# Altium project 数据收集器_Project.PrjPcb
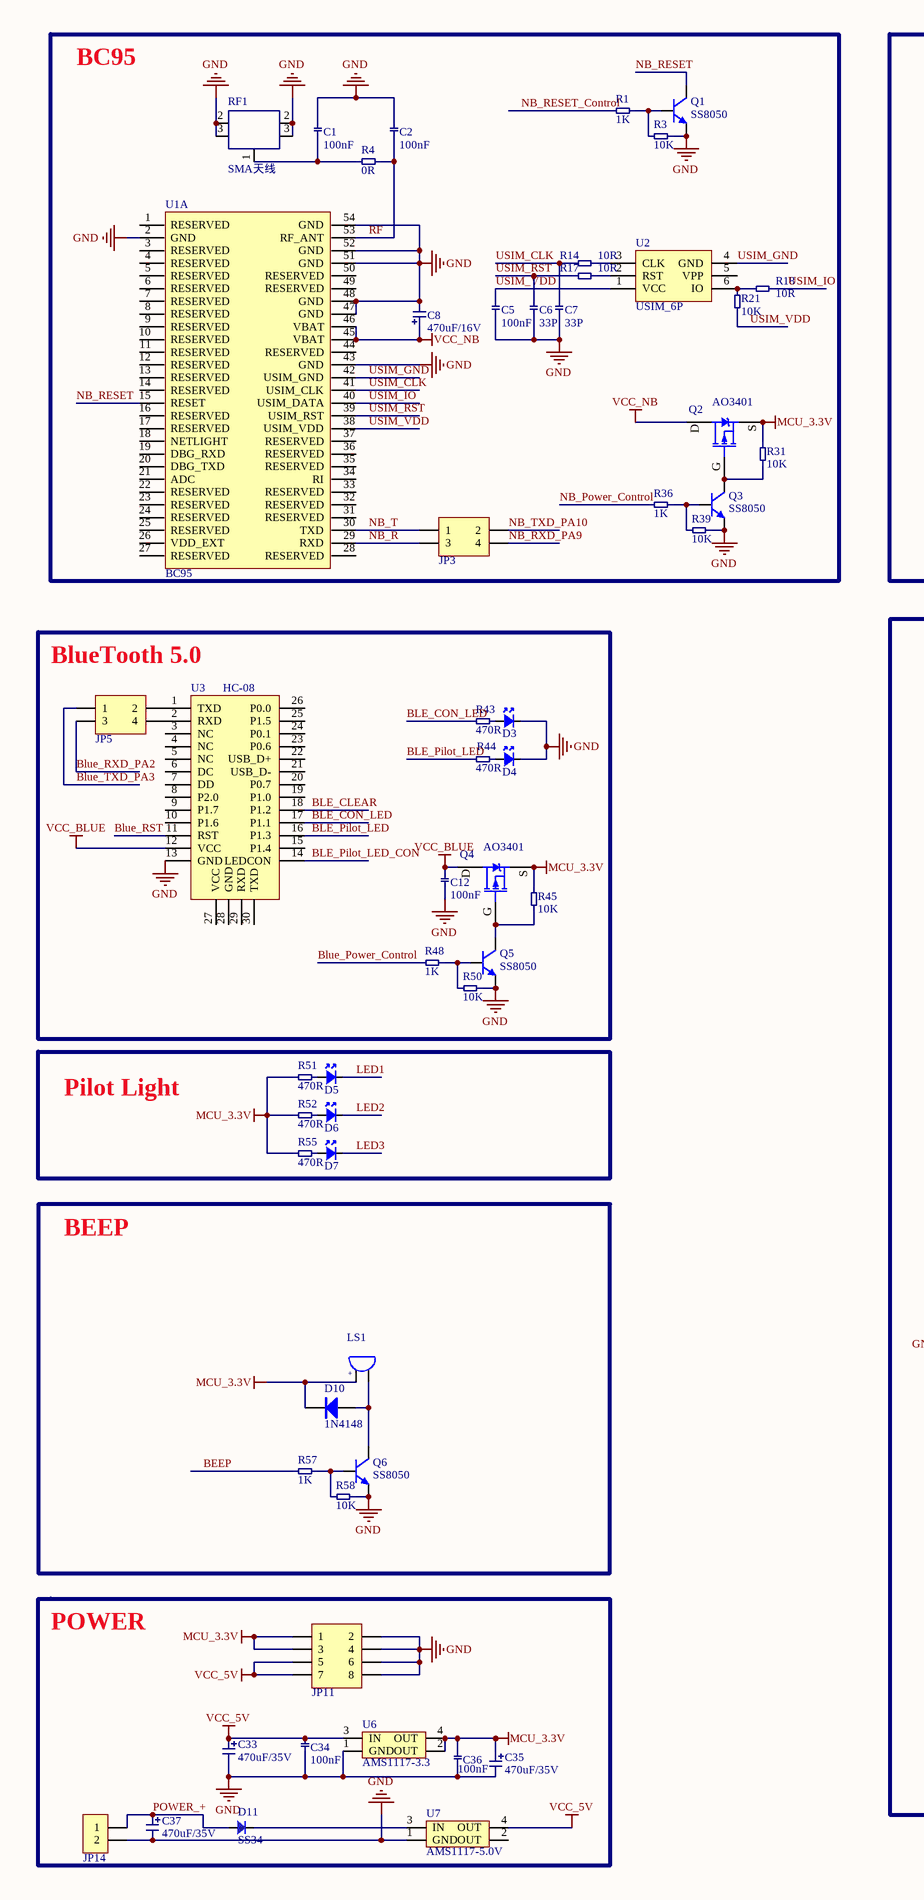
[diagram p0: MCU.SchDoc, left]
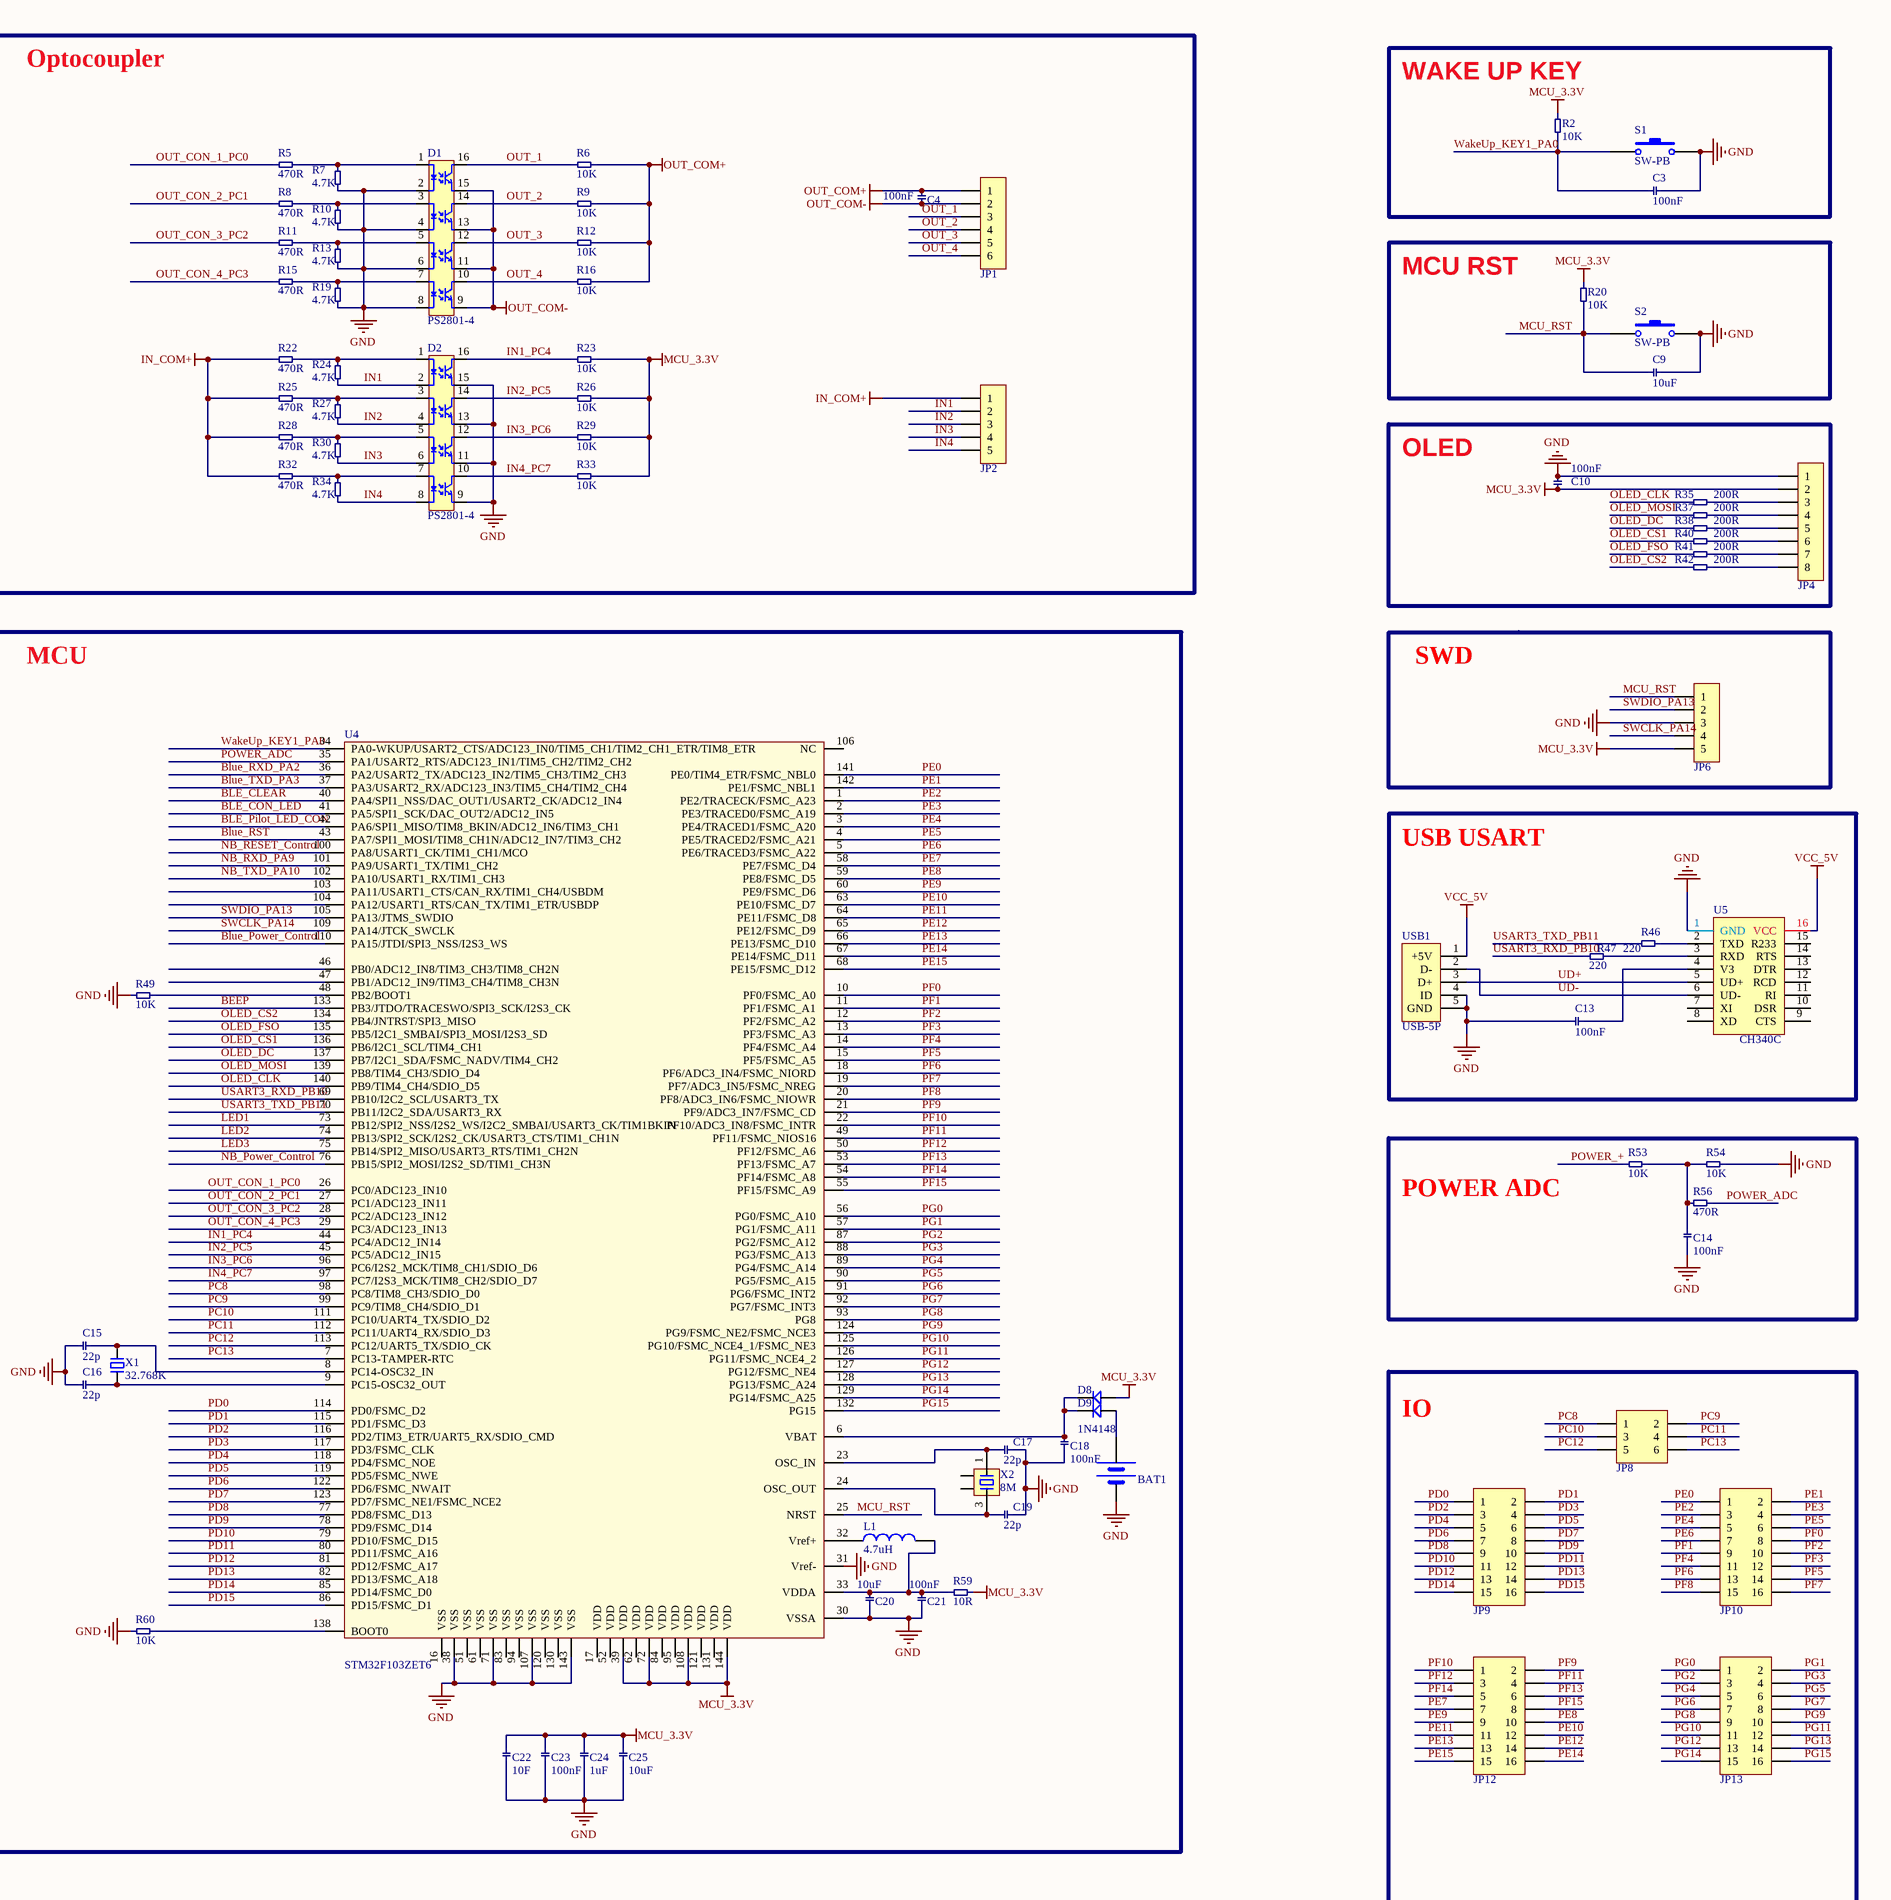
[diagram p1: MCU.SchDoc, right]
1 sheet, 135 parts. Net scope: global (net labels, ports and power ports of the same name join across sheets).
Board files: Main_Board.PcbDoc, PCB1_4.PcbDoc

## Sheet MCU.SchDoc
size A2; Organization: Altium Limited; Address1: L3, 12a Rodborough Rd; Address2: Frenchs Forest; Address3: NSW; Address4: Australia 2086

### Parts
BAT1  BATT  [VBAT]  (value not drawn)
C1  100nF  [0603CC]
C2  100nF  [0603CC]
C3  100nF  [0603CC]
C4  100nF  [0603CC]
C5  100nF  [0603CC]
C6  33P  [0603CC]
C7  33P  [0603CC]
C8  470uF/16V  [C3216]
C9  10uF  [0603CC]
C10  100nF  [0603CC]
C12  100nF  [0603CC]
C13  100nF  [0603CC]
C14  100nF  [0603CC]
C15  22p  [0603CC]
C16  22p  [0603CC]
C17  22p  [0603CC]
C18  100nF  [0603CC]
C19  22p  [0603CC]
C20  10uF  [0603CC]
C21  100nF  [0603CC]
C22  10F  [0603CC]
C23  100nF  [0603CC]
C24  1uF  [0603CC]
C25  10uF  [0603CC]
C33  470uF/35V  [CD A(3216)]
C34  100nF  [0603CC]
C35  470uF/35V  [C3216]
C36  100nF  [0603CC]
C37  470uF/35V  [CD A(3216)]
D1  PS2801-4  [SOP16_N]
D2  PS2801-4  [SOP16_N]
D3  LED  [LED 0603G]  (value not drawn)
D4  LED  [LED 0603R]  (value not drawn)
D5  LED  [LED 3MM-G]  (value not drawn)
D6  LED  [LED 3MM-B]  (value not drawn)
D7  LED  [LED 3MM-R]  (value not drawn)
D8  1N4148  [SOD-323]  (value not drawn)
D9  1N4148  [SOD-323]
D10  1N4148  [SOD-323]
D11  SS34  [SMA]
JP1  HDR-1X6  [XH2.54-LI-6P]  (value not drawn)
JP2  HDR-1X5  [XH2.54-LI-5P]  (value not drawn)
JP3  Header2X2  [HDR2.54-LI-2x2P]  (value not drawn)
JP4  HDR-1X8  [HDR2.54-M-LI-8P]  (value not drawn)
JP5  Header2X2  [HDR2.54-LI-2x2P]  (value not drawn)
JP6  HDR-1X5  [HDR2.54-LI-5P]  (value not drawn)
JP8  Header3X2  [HDR2.54-LI-2x3P]  (value not drawn)
JP9  Header 8X2  [HDR2.54-LI-2x8P]  (value not drawn)
JP10  Header 8X2  [HDR2.54-LI-2x8P]  (value not drawn)
JP11  Header 4X2  [HDR2.54-LI-2x4P]  (value not drawn)
JP12  Header 8X2  [HDR2.54-LI-2x8P]  (value not drawn)
JP13  Header 8X2  [HDR2.54-LI-2x8P]  (value not drawn)
JP14  HDR-1X2  [XH2.54-LI-2P]  (value not drawn)
L1  4.7uH  [L 0603]
LS1  DC5V  [BEEP 5x9x5.5]  (value not drawn)
Q1  SS8050  [SOT23-3N]
Q2  AO3401  [SOT23-3N]
Q3  SS8050  [SOT23-3N]
Q4  AO3401  [SOT23-3N]
Q5  SS8050  [SOT23-3N]
Q6  SS8050  [SOT23-3N]
R1  1K  [0603RR]
R2  10K  [0603RR]
R3  10K  [0603RR]
R4  0R  [0603RR]
R5  470R  [0603RR]
R6  10K  [0603RR]
R7  4.7K  [0603RR]
R8  470R  [0603RR]
R9  10K  [0603RR]
R10  4.7K  [0603RR]
R11  470R  [0603RR]
R12  10K  [0603RR]
R13  4.7K  [0603RR]
R14  10R  [0603RR]
R15  470R  [0603RR]
R16  10K  [0603RR]
R17  10R  [0603RR]
R18  10R  [0603RR]
R19  4.7K  [0603RR]
R20  10K  [0603RR]
R21  10K  [0603RR]
R22  470R  [0603RR]
R23  10K  [0603RR]
R24  4.7K  [0603RR]
R25  470R  [0603RR]
R26  10K  [0603RR]
R27  4.7K  [0603RR]
R28  470R  [0603RR]
R29  10K  [0603RR]
R30  4.7K  [0603RR]
R31  10K  [0603RR]
R32  470R  [0603RR]
R33  10K  [0603RR]
R34  4.7K  [0603RR]
R35  200R  [0603RR]
R36  1K  [0603RR]
R37  200R  [0603RR]
R38  200R  [0603RR]
R39  10K  [0603RR]
R40  200R  [0603RR]
R41  200R  [0603RR]
R42  200R  [0603RR]
R43  470R  [0603RR]
R44  470R  [0603RR]
R45  10K  [0603RR]
R46  220  [0603RR]
R47  220  [0603RR]
R48  1K  [0603RR]
R49  10K  [0603RR]
R50  10K  [0603RR]
R51  470R  [0603RR]
R52  470R  [0603RR]
R53  10K  [0603RR]
R54  10K  [0603RR]
R55  470R  [0603RR]
R56  470R  [0603RR]
R57  1K  [0603RR]
R58  10K  [0603RR]
R59  10R  [0603RR]
R60  10K  [0603RR]
RF1  SMA天线
S1  SW-PB  [TSW SMD-6*6*6]
S2  SW-PB  [TSW SMD-4*4*1.5]
U1  BC95  [BC95]  (part A of 2)
U2  USIM_6P  [SIM 6P 自弹]
U3  HC-08  [HC-08]
U4  STM32F103ZET6  [LQFP144 20X20_L]
U5  CH340C  [SOP16_L]
U6  AMS1117-3.3  [SOT223_N]
U7  AMS1117-5.0V  [SOT223_N]
USB1  USB-5P  [USB-MICRO_A]
X1  32.768K  [OSC 3215-2P]
X2  8M  [OSC 3225-4P]

### Nets
GND: BAT1.2(GND) C1.2 C2.2 C3.2 C5.1 C6.1 C7.1 C8.2 C9.1 C10.2 C12.1 C13.2 C14.1 C15.2 C16.2 C17.1 C18.1 C19.1 C20.1 C21.1 C22.1 C23.1 C24.1 C25.1 C33.2 C34.1 C35.2 C36.1 C37.2 D1.2(IN_N) D1.4(IN_N) D1.6(IN_N) D1.8(IN_N) D2.9(OUT_E) D2.11(OUT_E) D2.13(OUT_E) D2.15(OUT_E) D3.2(CATHODE) D4.2(CATHODE) JP4.1 JP6.3 JP11.2 JP11.4 JP11.6 JP11.8 JP14.2 Q1.2(E) Q3.2(E) Q5.2(E) Q6.2(E) R3.2 R7.1 R10.1 R13.1 R19.1 R39.2 R49.1 R50.2 R54.2 R58.2 R60.1 RF1.2 RF1.3 S1.2 S2.2 U1.2(GND) U1.43(GND) U1.47(GND) U1.48(GND) U1.51(GND) U1.52(GND) U1.54(GND) U3.13(GND) U4.30(VSSA) U4.31(Vref-) U4.38(VSS) U4.71(VSS) U4.107(VSS) U4.143(VSS) U5.1(GND) U6.1(GND) U7.1(GND) USB1.4(ID) USB1.5(GND)
IN_COM+: JP2.1 R22.1 R25.1 R28.1 R32.1
MCU_3.3V: C10.1 C22.2 C23.2 C24.2 C25.2 C35.1 C36.2 D8.1 D10.2(K) JP4.2 JP6.5 JP11.1 JP11.3 LS1.1 Q2.2(S) Q4.2(S) R2.2 R20.2 R23.2 R26.2 R29.2 R31.2 R33.2 R45.2 R51.1 R52.1 R55.1 R59.2 U4.39(VDD) U4.72(VDD) U4.108(VDD) U4.144(VDD) U6.2(OUT) U6.4(OUT)
OUT_COM+: C4.2 JP1.1 R6.1 R9.1 R12.1 R16.1
OUT_COM-: C4.1 D1.9(OUT_E) D1.11(OUT_E) D1.13(OUT_E) D1.15(OUT_E) JP1.2
VCC_5V: C33.1 C34.2 JP11.5 JP11.7 U5.16(VCC) U6.3(IN) U7.4(OUT) USB1.1(+5V)
VCC_BLUE: C12.2 Q4.3(D) U3.12(VCC)
VCC_NB: C8.1 Q2.3(D) U1.45(VBAT) U1.46(VBAT)
BEEP: R57.1 U4.133(PB3/JTDO/TRACESWO/SPI3_SCK/I2S3_CK)
BLE_CLEAR: U3.18(P1.2) U4.40(PA4/SPI1_NSS/DAC_OUT1/USART2_CK/ADC12_IN4)
BLE_CON_LED: R43.1 U3.17(P1.1) U4.41(PA5/SPI1_SCK/DAC_OUT2/ADC12_IN5)
BLE_Pilot_LED: R44.1 U3.16(P1.3)
BLE_Pilot_LED_CON: U3.14(LEDCON) U4.42(PA6/SPI1_MISO/TIM8_BKIN/ADC12_IN6/TIM3_CH1)
Blue_Power_Control: R48.1 U4.110(PA15/JTDI/SPI3_NSS/I2S3_WS)
Blue_RST: U3.11(RST) U4.43(PA7/SPI1_MOSI/TIM8_CH1N/ADC12_IN7/TIM3_CH2)
Blue_RXD_PA2: JP5.3 U4.36(PA2/USART2_TX/ADC123_IN2/TIM5_CH3/TIM2_CH3)
Blue_TXD_PA3: JP5.1 U4.37(PA3/USART2_RX/ADC123_IN3/TIM5_CH4/TIM2_CH4)
IN1: D2.2(IN_N) JP2.2 R24.1
IN1_PC4: D2.16(OUT_C) R23.1 U4.44(PC4/ADC12_IN14)
IN2: D2.4(IN_N) JP2.3 R27.1
IN2_PC5: D2.14(OUT_C) R26.1 U4.45(PC5/ADC12_IN15)
IN3: D2.6(IN_N) JP2.4 R30.1
IN3_PC6: D2.12(OUT_C) R29.1 U4.96(PC6/I2S2_MCK/TIM8_CH1/SDIO_D6)
IN4: D2.8(IN_N) JP2.5 R34.1
IN4_PC7: D2.10(OUT_C) R33.1 U4.97(PC7/I2S3_MCK/TIM8_CH2/SDIO_D7)
LED1: D5.2(CATHODE) U4.73(PB12/SPI2_NSS/I2S2_WS/I2C2_SMBAI/USART3_CK/TIM1BKIN)
LED2: D6.2(CATHODE) U4.74(PB13/SPI2_SCK/I2S2_CK/USART3_CTS/TIM1_CH1N)
LED3: D7.2(CATHODE) U4.75(PB14/SPI2_MISO/USART3_RTS/TIM1_CH2N)
MCU_RST: C9.2 JP6.1 R20.1 S2.1 U4.25(NRST)
NB_Power_Control: R36.1 U4.76(PB15/SPI2_MOSI/I2S2_SD/TIM1_CH3N)
NB_R: JP3.3 U1.29(RXD)
NB_RESET: Q1.3(C) U1.15(RESET)
NB_RESET_Control: R1.1 U4.100(PA8/USART1_CK/TIM1_CH1/MCO)
NB_RXD_PA9: JP3.4 U4.101(PA9/USART1_TX/TIM1_CH2)
NB_T: JP3.1 U1.30(TXD)
NB_TXD_PA10: JP3.2 U4.102(PA10/USART1_RX/TIM1_CH3)
OLED_CLK: R35.1 U4.140(PB9/TIM4_CH4/SDIO_D5)
OLED_CS1: R40.1 U4.136(PB6/I2C1_SCL/TIM4_CH1)
OLED_CS2: R42.1 U4.134(PB4/JNTRST/SPI3_MISO)
OLED_DC: R38.1 U4.137(PB7/I2C1_SDA/FSMC_NADV/TIM4_CH2)
OLED_FSO: R41.1 U4.135(PB5/I2C1_SMBAI/SPI3_MOSI/I2S3_SD)
OLED_MOSI: R37.1 U4.139(PB8/TIM4_CH3/SDIO_D4)
OUT_1: D1.16(OUT_C) JP1.3 R6.2
OUT_2: D1.14(OUT_C) JP1.4 R9.2
OUT_3: D1.12(OUT_C) JP1.5 R12.2
OUT_4: D1.10(OUT_C) JP1.6 R16.2
OUT_CON_1_PC0: R5.1 U4.26(PC0/ADC123_IN10)
OUT_CON_2_PC1: R8.1 U4.27(PC1/ADC123_IN11)
OUT_CON_3_PC2: R11.1 U4.28(PC2/ADC123_IN12)
OUT_CON_4_PC3: R15.1 U4.29(PC3/ADC123_IN13)
PC8: JP8.1 U4.98(PC8/TIM8_CH3/SDIO_D0)
PC9: JP8.2 U4.99(PC9/TIM8_CH4/SDIO_D1)
PC10: JP8.3 U4.111(PC10/UART4_TX/SDIO_D2)
PC11: JP8.4 U4.112(PC11/UART4_RX/SDIO_D3)
PC12: JP8.5 U4.113(PC12/UART5_TX/SDIO_CK)
PC13: JP8.6 U4.7(PC13-TAMPER-RTC)
PD0: JP9.1 U4.114(PD0/FSMC_D2)
PD1: JP9.2 U4.115(PD1/FSMC_D3)
PD2: JP9.3 U4.116(PD2/TIM3_ETR/UART5_RX/SDIO_CMD)
PD3: JP9.4 U4.117(PD3/FSMC_CLK)
PD4: JP9.5 U4.118(PD4/FSMC_NOE)
PD5: JP9.6 U4.119(PD5/FSMC_NWE)
PD6: JP9.7 U4.122(PD6/FSMC_NWAIT)
PD7: JP9.8 U4.123(PD7/FSMC_NE1/FSMC_NCE2)
PD8: JP9.9 U4.77(PD8/FSMC_D13)
PD9: JP9.10 U4.78(PD9/FSMC_D14)
PD10: JP9.11 U4.79(PD10/FSMC_D15)
PD11: JP9.12 U4.80(PD11/FSMC_A16)
PD12: JP9.13 U4.81(PD12/FSMC_A17)
PD13: JP9.14 U4.82(PD13/FSMC_A18)
PD14: JP9.15 U4.85(PD14/FSMC_D0)
PD15: JP9.16 U4.86(PD15/FSMC_D1)
PE0: JP10.1 U4.141(PE0/TIM4_ETR/FSMC_NBL0)
PE1: JP10.2 U4.142(PE1/FSMC_NBL1)
PE2: JP10.3 U4.1(PE2/TRACECK/FSMC_A23)
PE3: JP10.4 U4.2(PE3/TRACED0/FSMC_A19)
PE4: JP10.5 U4.3(PE4/TRACED1/FSMC_A20)
PE5: JP10.6 U4.4(PE5/TRACED2/FSMC_A21)
PE6: JP10.7 U4.5(PE6/TRACED3/FSMC_A22)
PE7: JP12.7 U4.58(PE7/FSMC_D4)
PE8: JP12.10 U4.59(PE8/FSMC_D5)
PE9: JP12.9 U4.60(PE9/FSMC_D6)
PE10: JP12.12 U4.63(PE10/FSMC_D7)
PE11: JP12.11 U4.64(PE11/FSMC_D8)
PE12: JP12.14 U4.65(PE12/FSMC_D9)
PE13: JP12.13 U4.66(PE13/FSMC_D10)
PE14: JP12.16 U4.67(PE14/FSMC_D11)
PE15: JP12.15 U4.68(PE15/FSMC_D12)
PF0: JP10.8 U4.10(PF0/FSMC_A0)
PF1: JP10.9 U4.11(PF1/FSMC_A1)
PF2: JP10.10 U4.12(PF2/FSMC_A2)
PF3: JP10.12 U4.13(PF3/FSMC_A3)
PF4: JP10.11 U4.14(PF4/FSMC_A4)
PF5: JP10.14 U4.15(PF5/FSMC_A5)
PF6: JP10.13 U4.18(PF6/ADC3_IN4/FSMC_NIORD)
PF7: JP10.16 U4.19(PF7/ADC3_IN5/FSMC_NREG)
PF8: JP10.15 U4.20(PF8/ADC3_IN6/FSMC_NIOWR)
PF9: JP12.2 U4.21(PF9/ADC3_IN7/FSMC_CD)
PF10: JP12.1 U4.22(PF10/ADC3_IN8/FSMC_INTR)
PF11: JP12.4 U4.49(PF11/FSMC_NIOS16)
PF12: JP12.3 U4.50(PF12/FSMC_A6)
PF13: JP12.6 U4.53(PF13/FSMC_A7)
PF14: JP12.5 U4.54(PF14/FSMC_A8)
PF15: JP12.8 U4.55(PF15/FSMC_A9)
PG0: JP13.1 U4.56(PG0/FSMC_A10)
PG1: JP13.2 U4.57(PG1/FSMC_A11)
PG2: JP13.3 U4.87(PG2/FSMC_A12)
PG3: JP13.4 U4.88(PG3/FSMC_A13)
PG4: JP13.5 U4.89(PG4/FSMC_A14)
PG5: JP13.6 U4.90(PG5/FSMC_A15)
PG6: JP13.7 U4.91(PG6/FSMC_INT2)
PG7: JP13.8 U4.92(PG7/FSMC_INT3)
PG8: JP13.9 U4.93(PG8)
PG9: JP13.10 U4.124(PG9/FSMC_NE2/FSMC_NCE3)
PG10: JP13.11 U4.125(PG10/FSMC_NCE4_1/FSMC_NE3)
PG11: JP13.12 U4.126(PG11/FSMC_NCE4_2)
PG12: JP13.13 U4.127(PG12/FSMC_NE4)
PG13: JP13.14 U4.128(PG13/FSMC_A24)
PG14: JP13.15 U4.129(PG14/FSMC_A25)
PG15: JP13.16 U4.132(PG15)
POWER_+: C37.1 D11.1(ANODE) JP14.1 R53.1
POWER_ADC: R56.1 U4.35(PA1/USART2_RTS/ADC123_IN1/TIM5_CH2/TIM2_CH2)
RF: C2.1 R4.1 U1.53(RF_ANT)
SWCLK_PA14: JP6.4 U4.109(PA14/JTCK_SWCLK)
SWDIO_PA13: JP6.2 U4.105(PA13/JTMS_SWDIO)
UD+: U5.5(UD+) USB1.3(D+)
UD-: U5.6(UD-) USB1.2(D-)
USART3_RXD_PB10: R47.1 U4.69(PB10/I2C2_SCL/USART3_TX)
USART3_TXD_PB11: R46.1 U4.70(PB11/I2C2_SDA/USART3_RX)
USIM_CLK: C7.2 R14.1 U1.41(USIM_CLK)
USIM_GND: U1.42(USIM_GND) U2.4(GND)
USIM_IO: R18.1 U1.40(USIM_DATA)
USIM_RST: C6.2 R17.1 U1.39(USIM_RST)
USIM_VDD: C5.2 R21.1 U1.38(USIM_VDD) U2.1(VCC)
WakeUp_KEY1_PA0: C3.1 R2.1 S1.1 U4.34(PA0-WKUP/USART2_CTS/ADC123_IN0/TIM5_CH1/TIM2_CH1_ETR/TIM8_ETR)
NetBAT1_1: BAT1.1(VCC) D9.1
NetC1_1: C1.1 R4.2 RF1.1
NetC13_1: C13.1 U5.4(V3)
NetC14_2: C14.2 R53.2 R54.1 R56.2
NetC15_1: C15.1 U4.8(PC14-OSC32_IN) X1.1
NetC16_1: C16.1 U4.9(PC15-OSC32_OUT) X1.2
NetC17_2: C17.2 U4.23(OSC_IN) X2.1
NetC18_2: C18.2 D8.2 D9.2 U4.6(VBAT)
NetC19_2: C19.2 U4.24(OSC_OUT) X2.3
NetC20_2: C20.2 C21.2 L1.2 R59.1 U4.33(VDDA)
NetD1_1: D1.1(IN_P) R5.2 R7.2
NetD1_3: D1.3(IN_P) R8.2 R10.2
NetD1_5: D1.5(IN_P) R11.2 R13.2
NetD1_7: D1.7(IN_P) R15.2 R19.2
NetD2_1: D2.1(IN_P) R22.2 R24.2
NetD2_3: D2.3(IN_P) R25.2 R27.2
NetD2_5: D2.5(IN_P) R28.2 R30.2
NetD2_7: D2.7(IN_P) R32.2 R34.2
NetD3_1: D3.1(ANODE) R43.2
NetD4_1: D4.1(ANODE) R44.2
NetD5_1: D5.1(ANODE) R51.2
NetD6_1: D6.1(ANODE) R52.2
NetD7_1: D7.1(ANODE) R55.2
NetD10_1: D10.1(A) LS1.2 Q6.3(C)
NetD11_2: D11.2(CATHODE) U7.3(IN)
NetJP4_3: JP4.3 R35.2
NetJP4_4: JP4.4 R37.2
NetJP4_5: JP4.5 R38.2
NetJP4_6: JP4.6 R40.2
NetJP4_7: JP4.7 R41.2
NetJP4_8: JP4.8 R42.2
NetJP5_2: JP5.2 U3.1(TXD)
NetJP5_4: JP5.4 U3.2(RXD)
NetL1_1: L1.1 U4.32(Vref+)
NetQ1_1: Q1.1(B) R1.2 R3.1
NetQ2_1: Q2.1(G) Q3.3(C) R31.1
NetQ3_1: Q3.1(B) R36.2 R39.1
NetQ4_1: Q4.1(G) Q5.3(C) R45.1
NetQ5_1: Q5.1(B) R48.2 R50.1
NetQ6_1: Q6.1(B) R57.2 R58.1
NetR14_2: R14.2 U2.3(CLK)
NetR17_2: R17.2 U2.2(RST)
NetR18_2: R18.2 R21.2 U2.6(IO)
NetR46_2: R46.2 U5.2(TXD)
NetR47_2: R47.2 U5.3(RXD)
NetR49_2: R49.2 U4.48(PB2/BOOT1)
NetR60_2: R60.2 U4.138(BOOT0)

Not connected (* = marked no-connect by the designer): U1 1(RESERVED) 3(RESERVED) 4(RESERVED) 5(RESERVED) 6(RESERVED) 7(RESERVED) 8(RESERVED) 9(RESERVED) 10(RESERVED) 11(RESERVED) 12(RESERVED) 13(RESERVED) 14(RESERVED) 16(RESERVED) 17(RESERVED) 18(NETLIGHT) 19(DBG_RXD) 20(DBG_TXD) 21(ADC) 22(RESERVED) 23(RESERVED) 24(RESERVED) 25(RESERVED) 26(VDD_EXT) 27(RESERVED) 28(RESERVED) 31(RESERVED) 32(RESERVED) 33(RESERVED) 34(RI) 35(RESERVED) 36(RESERVED) 37(RESERVED) 44(RESERVED) 49(RESERVED) 50(RESERVED); U2 5(VPP); U3 3(NC) 4(NC) 5(NC) 6(DC) 7(DD) 8(P2.0) 9(P1.7) 10(P1.6) 15(P1.4) 19(P1.0) 20(P0.7) 21(USB_D-) 22(USB_D+) 23(P0.6) 24(P0.1) 25(P1.5) 26(P0.0) 27(VCC) 28(GND) 29(RXD) 30(TXD); U4 16(VSS) 17(VDD) 46(PB0/ADC12_IN8/TIM3_CH3/TIM8_CH2N) 47(PB1/ADC12_IN9/TIM3_CH4/TIM8_CH3N) 51(VSS) 52(VDD) 61(VSS) 62(VDD) 83(VSS) 84(VDD) 94(VSS) 95(VDD) 103(PA11/USART1_CTS/CAN_RX/TIM1_CH4/USBDM) 104(PA12/USART1_RTS/CAN_TX/TIM1_ETR/USBDP) 106(NC) 120(VSS) 121(VDD) 130(VSS) 131(VDD); U5 7(XI) 8(XD) 9(CTS) 10(DSR) 11(RI) 12(RCD) 13(DTR) 14(RTS) 15(R233); U7 2(OUT); X2 2 4

### Notes on the sheet
- BC95
- Optocoupler
- (near R2) WAKE UP KEY
- MCU RST
- OLED
- BlueTooth 5.0
- MCU
- SWD
- USB USART
- Pilot Light
- POWER ADC
- BEEP
- IO
- POWER
- Title
- Size:
- Date:
- A3
- Number:
- Time:
- Revision:
- Sheet
- of
- File:
- (in symbol BEEP) +

### Library data of the parts
BAT1 = BAT
C1-C7 C9 C10 C12-C25 C34 C36 = cap
C8 C33 C35 C37 = Ecap
D1 D2 = PC847
D8 D9 = D
D10 = 1N4148: 高速开关二极管; 版权归属: 源创客; BOM名称: 高速开关二极管; 学习资源: www.ooocke.com
D11 = Diod
JP1 = Header 6: 6P接插件; 版权归属: 源创客; BOM名称: 6P接插件; 学习资源: www.ooocke.com
JP2 JP6 = Header 5: 5P接插件; 版权归属: 源创客; BOM名称: 5P接插件; 学习资源: www.ooocke.com
JP3 JP5 = Header 2X2: 2*2P接插件; 版权归属: 源创客; BOM名称: 2*2P接插件; 学习资源: www.ooocke.com
JP4 = Header 8: 8P接插件; 版权归属: 源创客; BOM名称: 8P接插件; 学习资源: www.ooocke.com
JP8 = Header 3X2: 3*2P接插件; 版权归属: 源创客; BOM名称: 3*2P接插件; 学习资源: www.ooocke.com
JP9 JP10 JP12 JP13 = Header 8X2: 8*2P接插件; 版权归属: 源创客; BOM名称: 8*2P接插件; 学习资源: www.ooocke.com
JP11 = Header 4X2: 4*2P接插件; 版权归属: 源创客; BOM名称: 4*2P接插件; 学习资源: www.ooocke.com
JP14 = Header 2: 2P接插件; 版权归属: 源创客; BOM名称: 2P接插件; 学习资源: www.ooocke.com
L1 = L: 小功率贴片电感; 版权归属: 源创客; BOM名称: 小功率贴片电感; 学习资源: www.ooocke.com
LS1 = BEEP: 蜂鸣器; 版权归属: 源创客; BOM名称: 蜂鸣器; 学习资源: www.ooocke.com
Q1 Q3 Q5 Q6 = 8050-SMD: 高频放大-NPN型; 版权归属: 源创客; 属性: 40V 1.5A 1W 100MHZ; BOM名称: 高频放大-NPN型; 学习资源: www.ooocke.com
Q2 Q4 = SI2301: P沟道场效应管; 版权归属: 源创客; BOM名称: P沟道场效应管; 学习资源: www.ooocke.com
R1-R60 = res
S1 S2 = SW-PB: Switch; Published: 24-Mar-1999; LatestRevisionDate: 17-Jul-2002; LatestRevisionNote: Re-released for DXP Platform.; PackageReference: SPST-2; Publisher: Altium Limited
U2 = USIM-6P
U6 U7 = AMS1117
USB1 = USB-5P: 微型USB母座; 版权归属: 源创客; BOM名称: 微型USB母座; 学习资源: www.ooocke.com
X1 = XTAL-2P: 2脚无源脚晶振; 版权归属: 源创客; BOM名称: 2脚无源脚晶振; 学习资源: www.ooocke.com
X2 = XTAL-4P: 4脚无源晶振; 版权归属: 源创客; BOM名称: 4脚无源晶振; 学习资源: www.ooocke.com
U1 = BC95: Value: *; Part Description: *; Height: *; Manufacture: *